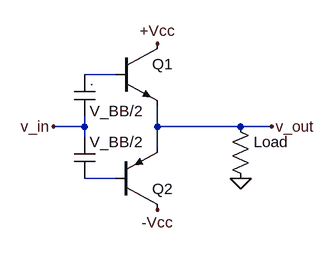
[diagram p0: schematic ClassAB.asc]
ClassAB.asc, the LTspice schematic file:
Version 4
SHEET 1 880 680
WIRE 96 64 48 64
WIRE 48 144 48 128
WIRE 48 144 0 144
WIRE 160 144 160 112
WIRE 288 144 160 144
WIRE 336 144 288 144
WIRE 48 160 48 144
WIRE 160 176 160 144
WIRE 96 224 48 224
FLAG 288 224 0
FLAG 160 16 +Vcc
FLAG 160 272 -Vcc
FLAG 0 144 v_in
FLAG 336 144 v_out
SYMBOL res 272 128 R0
SYMATTR InstName Load
SYMATTR Value ""
SYMBOL npn 96 16 R0
SYMATTR InstName Q1
SYMATTR Value ""
SYMBOL pnp 96 272 M180
SYMATTR InstName Q2
SYMATTR Value ""
SYMBOL cap 32 64 R0
SYMATTR InstName .
SYMATTR Value V_BB/2
SYMBOL cap 32 160 R0
SYMATTR InstName V_BB/2
SYMATTR Value ""

The netlist it stands for:
* ClassAB.asc
R§Load v_out 0
Q1 +Vcc N001 v_out 0
Q2 -Vcc N002 v_out 0
C§. N001 v_in V_BB/2
C§V_BB/2 v_in N002
.model NPN NPN
.model PNP PNP
.lib standard.bjt
.backanno
.end